# EAGLE schematic linuxstamp122 (EAGLE 5.03)
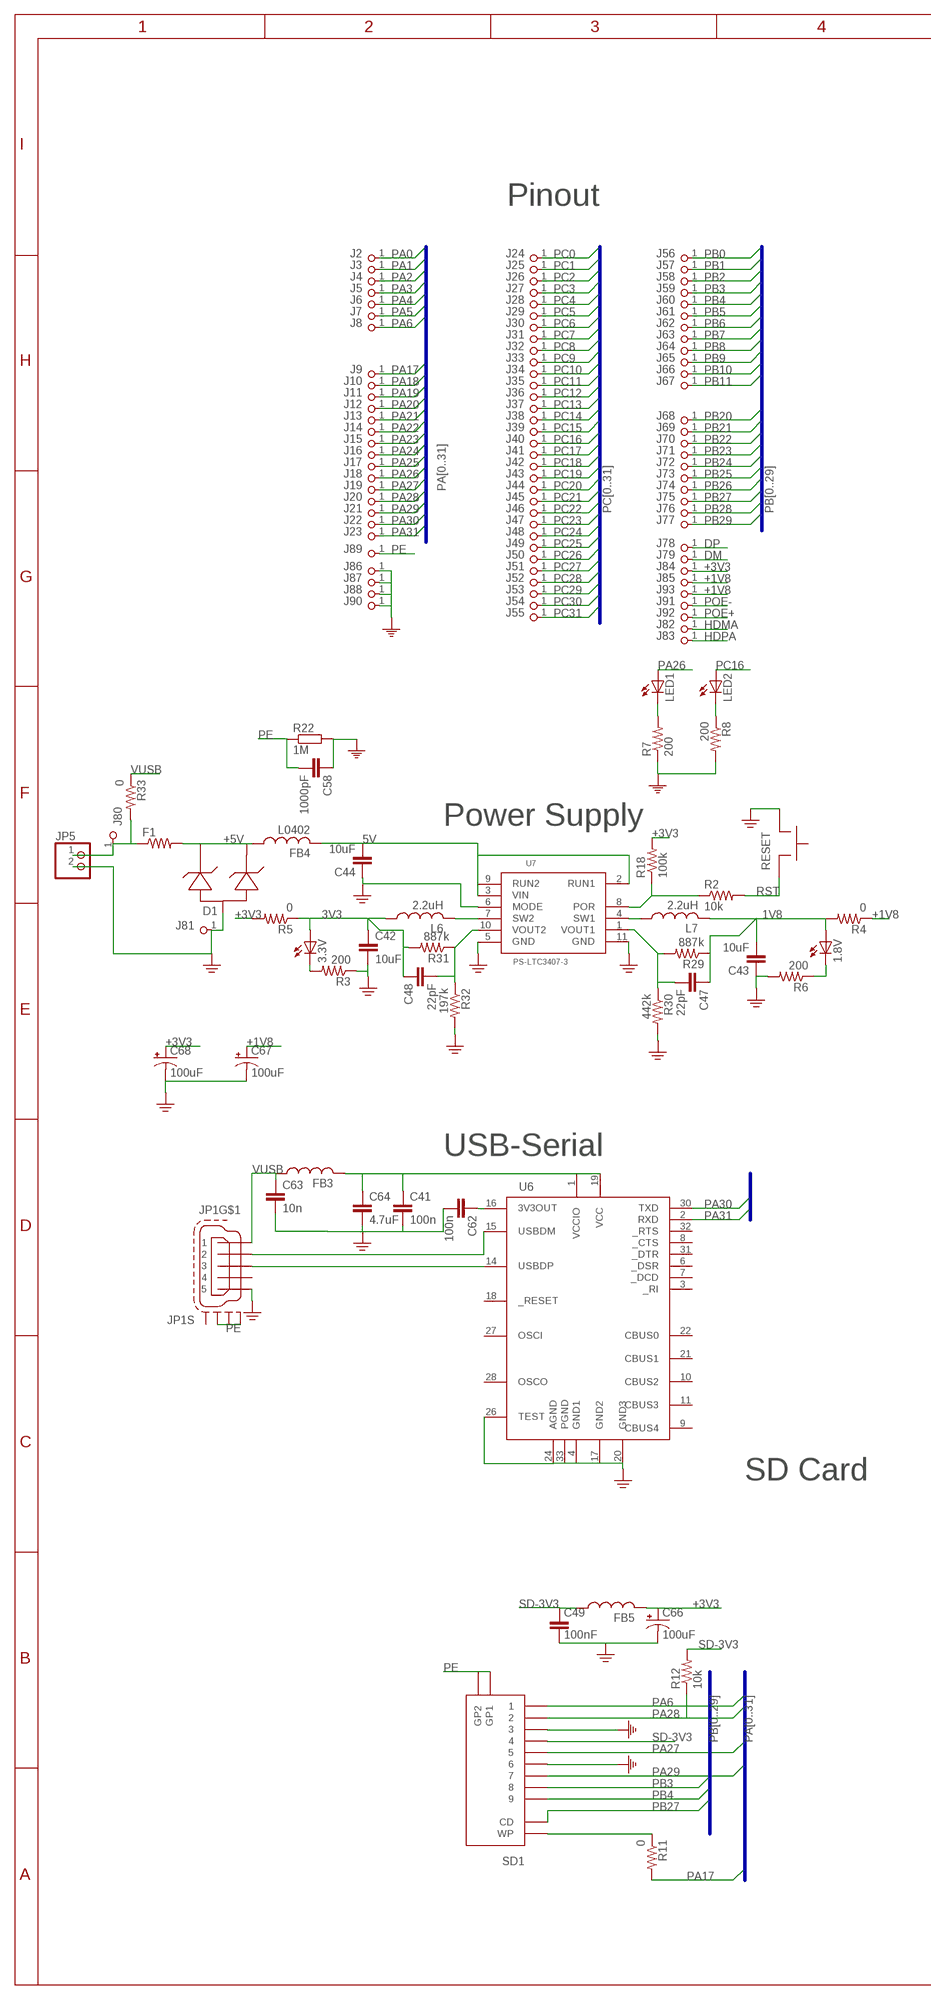
[diagram p0: schematic, sheet 1, part 1 of 2]
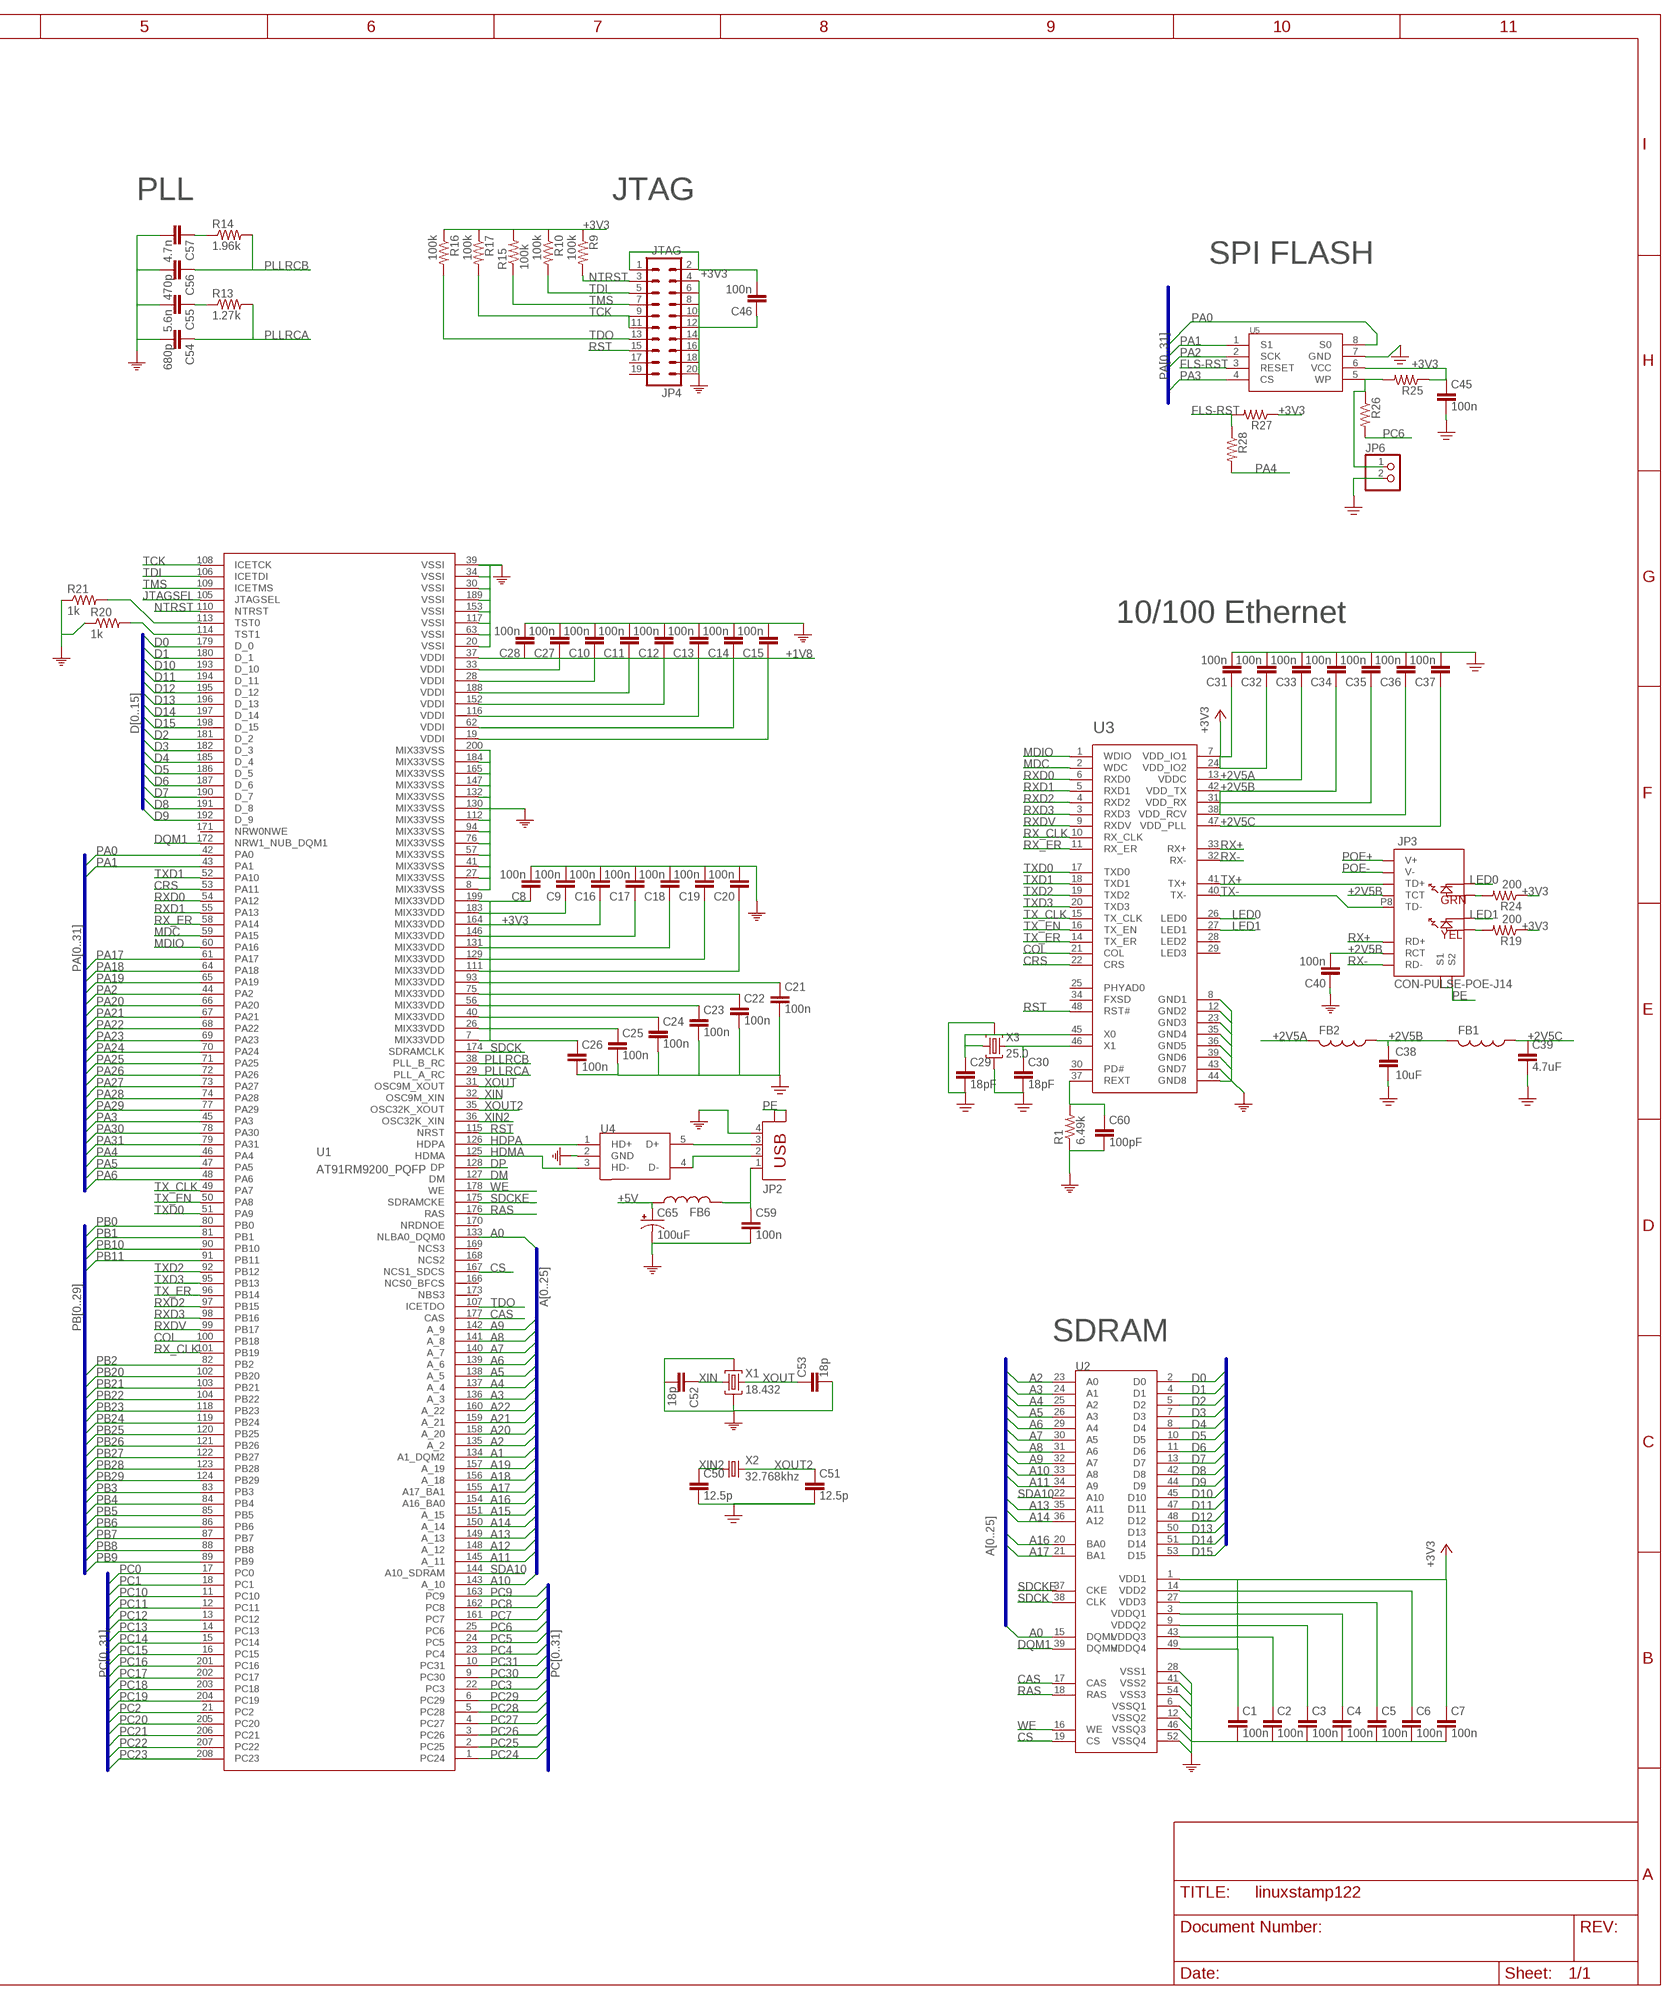
[diagram p1: schematic, sheet 1, part 2 of 2]

## Parts
1.8V  LEDCHIP-LED0603  [CHIP-LED0603]
3.3V  LEDCHIP-LED0603  [CHIP-LED0603]
C1  100n  C-USC0402  [C0402]
C2  100n  C-USC0402  [C0402]
C3  100n  C-USC0402  [C0402]
C4  100n  C-USC0402  [C0402]
C5  100n  C-USC0402  [C0402]
C6  100n  C-USC0402  [C0402]
C7  100n  C-USC0402  [C0402]
C8  100n  C-USC0402  [C0402]
C9  100n  C-USC0402  [C0402]
C10  100n  C-USC0402  [C0402]
C11  100n  C-USC0402  [C0402]
C12  100n  C-USC0402  [C0402]
C13  100n  C-USC0402  [C0402]
C14  100n  C-USC0402  [C0402]
C15  100n  C-USC0402  [C0402]
C16  100n  C-USC0402  [C0402]
C17  100n  C-USC0402  [C0402]
C18  100n  C-USC0402  [C0402]
C19  100n  C-USC0402  [C0402]
C20  100n  C-USC0402  [C0402]
C21  100n  C-USC0402  [C0402]
C22  100n  C-USC0402  [C0402]
C23  100n  C-USC0402  [C0402]
C24  100n  C-USC0402  [C0402]
C25  100n  C-USC0402  [C0402]
C26  100n  C-USC0402  [C0402]
C27  100n  C-USC0402  [C0402]
C28  100n  C-USC0402  [C0402]
C29  18pF  C-USC0402  [C0402]
C30  18pF  C-USC0402  [C0402]
C31  100n  C-USC0402  [C0402]
C32  100n  C-USC0402  [C0402]
C33  100n  C-USC0402  [C0402]
C34  100n  C-USC0402  [C0402]
C35  100n  C-USC0402  [C0402]
C36  100n  C-USC0402  [C0402]
C37  100n  C-USC0402  [C0402]
C38  10uF  C-EUC0805K  [C0805K]
C39  4.7uF  C-USC0603  [C0603]
C40  100n  C-USC0402  [C0402]
C41  100n  C0402  [0402]
C42  10uF  C-EUC0805K  [C0805K]
C43  10uF  C-EUC0805K  [C0805K]
C44  10uF  C-EUC0805K  [C0805K]
C45  100n  C-USC0402  [C0402]
C46  100n  C-USC0402  [C0402]
C47  22pF  C0402  [0402]
C48  22pF  C0402  [0402]
C49  100nF  C-USC0402  [C0402]
C50  12.5p  C-USC0402  [C0402]
C51  12.5p  C-USC0402  [C0402]
C52  18p  C-USC0402  [C0402]
C53  18p  C-USC0402  [C0402]
C54  680p  C-USC0402  [C0402]
C55  5.6n  C-USC0402  [C0402]
C56  470p  C-USC0402  [C0402]
C57  4.7n  C-USC0402  [C0402]
C58  1000pF  C-EUC1206  [C1206]
C59  100n  C-USC0402  [C0402]
C60  100pF  C-USC0402  [C0402]
C62  100n  C0402  [0402]
C63  10n  C0402  [0402]
C64  4.7uF  C-EUC0603  [C0603]
C65  100uF  CPOL-USC/6032-28R  [C/6032-28R]
C66  100uF  CPOL-USC/6032-28R  [C/6032-28R]
C67  100uF  CPOL-USC/6032-28R  [C/6032-28R]
C68  100uF  CPOL-USC/6032-28R  [C/6032-28R]
D1  DIODE-DUAL-ZENER  [SOT23]
F1  R-US_R1206  [R1206]
FB1  L0402  [0402]
FB2  L0402  [0402]
FB3  L0402  [0402]
FB4  L0402  [0402]
FB5  L0402  [0402]
FB6  L0402  [0402]
J2  PINHD-1X1  [1X01]
J3  PINHD-1X1  [1X01]
J4  PINHD-1X1  [1X01]
J5  PINHD-1X1  [1X01]
J6  PINHD-1X1  [1X01]
J7  PINHD-1X1  [1X01]
J8  PINHD-1X1  [1X01]
J9  PINHD-1X1  [1X01]
J10  PINHD-1X1  [1X01]
J11  PINHD-1X1  [1X01]
J12  PINHD-1X1  [1X01]
J13  PINHD-1X1  [1X01]
J14  PINHD-1X1  [1X01]
J15  PINHD-1X1  [1X01]
J16  PINHD-1X1  [1X01]
J17  PINHD-1X1  [1X01]
J18  PINHD-1X1  [1X01]
J19  PINHD-1X1  [1X01]
J20  PINHD-1X1  [1X01]
J21  PINHD-1X1  [1X01]
J22  PINHD-1X1  [1X01]
J23  PINHD-1X1  [1X01]
J24  PINHD-1X1  [1X01]
J25  PINHD-1X1  [1X01]
J26  PINHD-1X1  [1X01]
J27  PINHD-1X1  [1X01]
J28  PINHD-1X1  [1X01]
J29  PINHD-1X1  [1X01]
J30  PINHD-1X1  [1X01]
J31  PINHD-1X1  [1X01]
J32  PINHD-1X1  [1X01]
J33  PINHD-1X1  [1X01]
J34  PINHD-1X1  [1X01]
J35  PINHD-1X1  [1X01]
J36  PINHD-1X1  [1X01]
J37  PINHD-1X1  [1X01]
J38  PINHD-1X1  [1X01]
J39  PINHD-1X1  [1X01]
J40  PINHD-1X1  [1X01]
J41  PINHD-1X1  [1X01]
J42  PINHD-1X1  [1X01]
J43  PINHD-1X1  [1X01]
J44  PINHD-1X1  [1X01]
J45  PINHD-1X1  [1X01]
J46  PINHD-1X1  [1X01]
J47  PINHD-1X1  [1X01]
J48  PINHD-1X1  [1X01]
J49  PINHD-1X1  [1X01]
J50  PINHD-1X1  [1X01]
J51  PINHD-1X1  [1X01]
J52  PINHD-1X1  [1X01]
J53  PINHD-1X1  [1X01]
J54  PINHD-1X1  [1X01]
J55  PINHD-1X1  [1X01]
J56  PINHD-1X1  [1X01]
J57  PINHD-1X1  [1X01]
J58  PINHD-1X1  [1X01]
J59  PINHD-1X1  [1X01]
J60  PINHD-1X1  [1X01]
J61  PINHD-1X1  [1X01]
J62  PINHD-1X1  [1X01]
J63  PINHD-1X1  [1X01]
J64  PINHD-1X1  [1X01]
J65  PINHD-1X1  [1X01]
J66  PINHD-1X1  [1X01]
J67  PINHD-1X1  [1X01]
J68  PINHD-1X1  [1X01]
J69  PINHD-1X1  [1X01]
J70  PINHD-1X1  [1X01]
J71  PINHD-1X1  [1X01]
J72  PINHD-1X1  [1X01]
J73  PINHD-1X1  [1X01]
J74  PINHD-1X1  [1X01]
J75  PINHD-1X1  [1X01]
J76  PINHD-1X1  [1X01]
J77  PINHD-1X1  [1X01]
J78  PINHD-1X1  [1X01]
J79  PINHD-1X1  [1X01]
J80  PINHD-1X1  [1X01]
J81  PINHD-1X1  [1X01]
J82  j85  PINHD-1X1  [1X01]
J83  j85  PINHD-1X1  [1X01]
J84  j85  PINHD-1X1  [1X01]
J85  j85  PINHD-1X1  [1X01]
J86  PINHD-1X1  [1X01]
J87  j85  PINHD-1X1  [1X01]
J88  j85  PINHD-1X1  [1X01]
J89  j85  PINHD-1X1  [1X01]
J90  j85  PINHD-1X1  [1X01]
J91  j85  PINHD-1X1  [1X01]
J92  j85  PINHD-1X1  [1X01]
J93  j85  PINHD-1X1  [1X01]
JP1  MINI-USB-SCHIELD-32005-201  [32005-201]
JP2  PN87520  [PN87520]
JP3  CON-PULSE-POE-J14  [CON-PULSE-POE-J415]
JP4  JTAG  MA10-2  [MA10-2]
JP5  CON-PC-5.0-2  [CON-PC-5.0-2]
JP6  PINHD-1X2  [1X02]
L6  2.2uH  L-USL1812  [L1812]
L7  2.2uH  L-USL1812  [L1812]
LED1  LEDCHIP-LED0603  [CHIP-LED0603]
LED2  LEDCHIP-LED0603  [CHIP-LED0603]
R1  6.49k  R-US_R0402  [R0402]
R2  10k  R0402  [0402]
R3  200  R0402  [0402]
R4  0  R0402  [0402]
R5  0  R0402  [0402]
R6  200  R0402  [0402]
R7  200  R0402  [0402]
R8  200  R0402  [0402]
R9  100k  R-US_R0402  [R0402]
R10  100k  R-US_R0402  [R0402]
R11  0  R-US_R0402  [R0402]
R12  10k  R-US_R0402  [R0402]
R13  1.27k  R-US_R0402  [R0402]
R14  1.96k  R-US_R0402  [R0402]
R15  100k  R-US_R0402  [R0402]
R16  100k  R-US_R0402  [R0402]
R17  100k  R-US_R0402  [R0402]
R18  100k  R0402  [0402]
R19  200  R-US_R0402  [R0402]
R20  1k  R-US_R0402  [R0402]
R21  1k  R-US_R0402  [R0402]
R22  1M  R-EU_R1206  [R1206]
R24  200  R-US_R0402  [R0402]
R25  R-US_R0402  [R0402]
R26  R-US_R0402  [R0402]
R27  R-US_R0402  [R0402]
R28  R-US_R0402  [R0402]
R29  887k  R0402  [0402]
R30  442k  R0402  [0402]
R31  887k  R0402  [0402]
R32  197k  R0402  [0402]
R33  0  R0402  [0402]
RESET  SWITCH-PUSHBUTTON-6X3.5  [SWITCH-6X3.5]
SD1  CON-EM-SD  [CON-3M-SD]
U1  AT91RM9200_PQFP  [LQFP208]
U2  MT48LC8M16A2  [TSOPII-54]
U3  MICREL-KS8721  [TQFP48]
U4  USBDF01W5  [SOT323-5]
U5  DATAFLASH-8  [CASON-8]
U6  FT232RQ2  [MLF32_2]
U7  PS-LTC3407-3  [DFN-10]
X1  18.432  CRYSTAL-3.2-2.5  [CRYSTAL-3.2-2.5]
X2  32.768khz  CRYTALMM20SS  [MM20SS]
X3  25.0  CRYSTAL-3.2-2.5  [CRYSTAL-3.2-2.5]

## Nets
1V8: 1.8V.A C43.2 C47.1 L7.2 R4.2 R29.1
3V3: 3.3V.A C42.1 C48.1 L6.1 R5.1 R31.2
5V: C44.2 FB4.2 U7.2(RUN1) U7.3(VIN) U7.9(RUN2)
+1V8: C10.1 C11.1 C12.1 C13.1 C14.1 C15.1 C27.1 C28.1 C67.+ J85.1 J93.1 R4.1 U1.19(VDDI) U1.28(VDDI) U1.33(VDDI) U1.37(VDDI) U1.62(VDDI) U1.116(VDDI) U1.152(VDDI) U1.188(VDDI)
+2V5A: C33.1 FB2.2 U3.13(VDDC)
+2V5B: C34.1 C35.1 C36.1 C38.1 C40.2 FB1.2 FB2.1 JP3.P1(TCT) JP3.P9(RCT) U3.31(VDD_RX) U3.38(VDD_RCV) U3.42(VDD_TX)
+2V5C: C37.1 C39.1 FB1.1 U3.47(VDD_PLL)
+3V3: C1.1 C2.1 C3.1 C4.1 C5.1 C6.1 C7.1 C8.1 C9.1 C16.1 C17.1 C18.1 C19.1 C20.1 C21.1 C22.1 C23.1 C24.1 C25.1 C26.1 C31.1 C32.1 C45.1 C46.2 C66.+ C68.+ FB5.2 J84.1 JP4.1 JP4.2 R5.2 R9.1 R10.1 R15.2 R16.1 R17.1 R18.2 R19.1 R24.1 R25.1 R27.1 U1.7(MIX33VDD) U1.26(MIX33VDD) U1.40(MIX33VDD) U1.56(MIX33VDD) U1.75(MIX33VDD) U1.93(MIX33VDD) U1.111(MIX33VDD) U1.129(MIX33VDD) U1.131(MIX33VDD) U1.146(MIX33VDD) U1.164(MIX33VDD) U1.183(MIX33VDD) U1.199(MIX33VDD) U2.1(VDD1) U2.3(VDDQ1) U2.9(VDDQ2) U2.14(VDD2) U2.27(VDD3) U2.43(VDDQ3) U2.49(VDDQ4) U3.7(VDD_IO1) U3.24(VDD_IO2) U5.6(VCC)
+5V: C65.+ D1.1 D1.2 F1.2 FB4.1 FB6.1
A0: U1.133(NLBA0_DQM0) U2.15(DQML)
A1: U1.134(A1_DQM2)
A2: U1.135(A_2) U2.23(A0)
A3: U1.136(A_3) U2.24(A1)
A4: U1.137(A_4) U2.25(A2)
A5: U1.138(A_5) U2.26(A3)
A6: U1.139(A_6) U2.29(A4)
A7: U1.140(A_7) U2.30(A5)
A8: U1.141(A_8) U2.31(A6)
A9: U1.142(A_9) U2.32(A7)
A10: U1.143(A_10) U2.33(A8)
A11: U1.145(A_11) U2.34(A9)
A12: U1.148(A_12)
A13: U1.149(A_13) U2.35(A11)
A14: U1.150(A_14) U2.36(A12)
A15: U1.151(A_15)
A16: U1.154(A16_BA0) U2.20(BA0)
A17: U1.155(A17_BA1) U2.21(BA1)
A18: U1.156(A_18)
A19: U1.157(A_19)
A20: U1.158(A_20)
A21: U1.159(A_21)
A22: U1.160(A_22)
CAS: U1.177(CAS) U2.17(CAS)
COL: U1.100(PB18) U3.21(COL)
CRS: U1.53(PA11) U3.22(CRS)
CS: U1.167(NCS1_SDCS) U2.19(CS)
D0: U1.179(D_0) U2.2(D0)
D1: U1.180(D_1) U2.4(D1)
D2: U1.181(D_2) U2.5(D2)
D3: U1.182(D_3) U2.7(D3)
D4: U1.185(D_4) U2.8(D4)
D5: U1.186(D_5) U2.10(D5)
D6: U1.187(D_6) U2.11(D6)
D7: U1.190(D_7) U2.13(D7)
D8: U1.191(D_8) U2.42(D8)
D9: U1.192(D_9) U2.44(D9)
D10: U1.193(D_10) U2.45(D10)
D11: U1.194(D_11) U2.47(D11)
D12: U1.195(D_12) U2.48(D12)
D13: U1.196(D_13) U2.50(D13)
D14: U1.197(D_14) U2.51(D14)
D15: U1.198(D_15) U2.53(D15)
DM: J79.1 U1.127(DM)
DP: J78.1 U1.128(DP)
DQM1: U1.172(NRW1_NUB_DQM1) U2.39(DQMH)
FLS-RST: R27.2 R28.1 U5.3(RESET)
GND: C1.2 C2.2 C3.2 C4.2 C5.2 C6.2 C7.2 C8.2 C9.2 C10.2 C11.2 C12.2 C13.2 C14.2 C15.2 C16.2 C17.2 C18.2 C19.2 C20.2 C21.2 C22.2 C23.2 C24.2 C25.2 C26.2 C27.2 C28.2 C29.2 C30.2 C31.2 C32.2 C33.2 C34.2 C35.2 C36.2 C37.2 C38.2 C39.2 C40.1 C41.2 C42.2 C43.1 C44.1 C45.2 C46.1 C49.2 C50.2 C51.2 C52.2 C53.2 C54.2 C55.2 C56.2 C57.2 C58.1 C59.2 C60.2 C62.2 C63.2 C64.2 C65.- C66.- C67.- C68.- D1.3 J81.1 J86.1 J87.1 J88.1 J90.1 JP1.5 JP2.4 JP4.4 JP4.6 JP4.8 JP4.10 JP4.12 JP4.14 JP4.16 JP4.18 JP4.20 JP5.2 JP6.2 R1.1 R3.1 R6.2 R7.1 R8.2 R20.1 R21.1 R22.2 R30.2 R32.2 RESET.1 SD1.3 SD1.6 U1.8(MIX33VSS) U1.20(VSSI) U1.27(MIX33VSS) U1.30(VSSI) U1.34(VSSI) U1.39(VSSI) U1.41(MIX33VSS) U1.57(MIX33VSS) U1.63(VSSI) U1.76(MIX33VSS) U1.94(MIX33VSS) U1.112(MIX33VSS) U1.117(VSSI) U1.130(MIX33VSS) U1.132(MIX33VSS) U1.147(MIX33VSS) U1.153(VSSI) U1.165(MIX33VSS) U1.184(MIX33VSS) U1.189(VSSI) U1.200(MIX33VSS) U2.6(VSSQ1) U2.12(VSSQ2) U2.28(VSS1) U2.41(VSS2) U2.46(VSSQ3) U2.52(VSSQ4) U2.54(VSS3) U3.8(GND1) U3.12(GND2) U3.23(GND3) U3.35(GND4) U3.36(GND5) U3.39(GND6) U3.43(GND7) U3.44(GND8) U4.2(GND) U5.7(GND) U6.4(GND1) U6.17(GND2) U6.20(GND3) U6.24(AGND) U6.26(TEST) U6.33(PGND) U7.5(GND) U7.6(MODE) U7.11(GND) X1.2(GND) X1.4(GND) X3.2(GND) X3.4(GND)
HDMA: J82.1 U1.125(HDMA) U4.3(HD-)
HDPA: J83.1 U1.126(HDPA) U4.1(HD+)
J1: JP2.2 U4.4(D-)
JTAGSEL: U1.105(JTAGSEL)
LED0: JP3.P13(GC) U3.26(LED0)
LED1: JP3.P16(YC) U3.27(LED1)
MDC: U1.59(PA15) U3.2(WDC)
MDIO: U1.60(PA16) U3.1(WDIO)
N$1: JP3.P14(GA) R24.2
N$2: JP3.P15(YA) R19.2
N$3: 3.3V.C R3.2
N$5: C30.1 U3.46(X1) X3.3(C2)
N$6: C29.1 U3.45(X0) X3.1(C1)
N$7: C60.1 R1.2 U3.37(REXT)
N$8: C59.1 FB6.2 JP2.1
N$10: JP2.3 U4.5(D+)
N$11: L6.2 U7.7(SW2)
N$12: JP1.3 U6.14(USBDP)
N$13: C47.2 R29.2 R30.1 U7.1(VOUT1)
N$14: JP1.2 U6.15(USBDM)
N$15: C41.1 C64.1 FB3.2 U6.1(VCCIO) U6.19(VCC)
N$16: C62.1 U6.16(3V3OUT)
N$17: L7.1 U7.4(SW1)
N$18: R2.1 R18.1 U7.8(POR)
N$19: C48.2 R31.1 R32.1 U7.10(VOUT2)
N$20: 1.8V.C R6.1
N$21: LED1.C R7.2
N$22: LED2.C R8.1
N$23: JP6.1 R25.2 R26.1 U5.5(WP)
N$24: F1.1 J80.1 JP5.1 R33.2
N$35: R11.1 SD1.WP
N$37: C55.1 R13.1
N$39: C57.1 R14.1
N$41: R20.2 U1.114(TST1)
N$42: R21.2 U1.113(TST0)
NTRST: JP4.3 R9.2 U1.110(NTRST)
PA0: J2.1 U1.42(PA0) U5.8(S0)
PA1: J3.1 U1.43(PA1) U5.1(S1)
PA2: J4.1 U1.44(PA2) U5.2(SCK)
PA3: J5.1 U1.45(PA3) U5.4(CS)
PA4: J6.1 R28.2 U1.46(PA4)
PA5: J7.1 U1.47(PA5)
PA6: J8.1 SD1.1 U1.48(PA6)
PA17: J9.1 R11.2 U1.61(PA17)
PA18: J10.1 U1.64(PA18)
PA19: J11.1 U1.65(PA19)
PA20: J12.1 U1.66(PA20)
PA21: J13.1 U1.67(PA21)
PA22: J14.1 U1.68(PA22)
PA23: J15.1 U1.69(PA23)
PA24: J16.1 U1.70(PA24)
PA25: J17.1 U1.71(PA25)
PA26: J18.1 LED1.A U1.72(PA26)
PA27: J19.1 SD1.5 U1.73(PA27)
PA28: J20.1 R12.1 SD1.2 U1.74(PA28)
PA29: J21.1 SD1.7 U1.77(PA29)
PA30: J22.1 U1.78(PA30) U6.30(TXD)
PA31: J23.1 U1.79(PA31) U6.2(RXD)
PB0: J56.1 U1.80(PB0)
PB1: J57.1 U1.81(PB1)
PB2: J58.1 U1.82(PB2)
PB3: J59.1 SD1.8 U1.83(PB3)
PB4: J60.1 SD1.9 U1.84(PB4)
PB5: J61.1 U1.85(PB5)
PB6: J62.1 U1.86(PB6)
PB7: J63.1 U1.87(PB7)
PB8: J64.1 U1.88(PB8)
PB9: J65.1 U1.89(PB9)
PB10: J66.1 U1.90(PB10)
PB11: J67.1 U1.91(PB11)
PB20: J68.1 U1.102(PB20)
PB21: J69.1 U1.103(PB21)
PB22: J70.1 U1.104(PB22)
PB23: J71.1 U1.118(PB23)
PB24: J72.1 U1.119(PB24)
PB25: J73.1 U1.120(PB25)
PB26: J74.1 U1.121(PB26)
PB27: J75.1 SD1.CD U1.122(PB27)
PB28: J76.1 U1.123(PB28)
PB29: J77.1 U1.124(PB29)
PC0: J24.1 U1.17(PC0)
PC1: J25.1 U1.18(PC1)
PC2: J26.1 U1.21(PC2)
PC3: J27.1 U1.22(PC3)
PC4: J28.1 U1.23(PC4)
PC5: J29.1 U1.24(PC5)
PC6: J30.1 R26.2 U1.25(PC6)
PC7: J31.1 U1.161(PC7)
PC8: J32.1 U1.162(PC8)
PC9: J33.1 U1.163(PC9)
PC10: J34.1 U1.11(PC10)
PC11: J35.1 U1.12(PC11)
PC12: J36.1 U1.13(PC12)
PC13: J37.1 U1.14(PC13)
PC14: J38.1 U1.15(PC14)
PC15: J39.1 U1.16(PC15)
PC16: J40.1 LED2.A U1.201(PC16)
PC17: J41.1 U1.202(PC17)
PC18: J42.1 U1.203(PC18)
PC19: J43.1 U1.204(PC19)
PC20: J44.1 U1.205(PC20)
PC21: J45.1 U1.206(PC21)
PC22: J46.1 U1.207(PC22)
PC23: J47.1 U1.208(PC23)
PC24: J48.1 U1.1(PC24)
PC25: J49.1 U1.2(PC25)
PC26: J50.1 U1.3(PC26)
PC27: J51.1 U1.4(PC27)
PC28: J52.1 U1.5(PC28)
PC29: J53.1 U1.6(PC29)
PC30: J54.1 U1.9(PC30)
PC31: J55.1 U1.10(PC31)
PE: C58.2 J89.1 JP1.M1(S:S1) JP1.M2(S:S2) JP1.M3(S:S3) JP2.G1 JP2.G2 JP3.S1 JP3.S2 R22.1 SD1.GP1 SD1.GP2
PLLRCA: C54.1 R13.2 U1.29(PLL_A_RC)
PLLRCB: C56.1 R14.2 U1.38(PLL_B_RC)
POE+: J92.1 JP3.P5(V+)
POE-: J91.1 JP3.P6(V-)
RAS: U1.176(RAS) U2.18(RAS)
RST: JP4.15 R2.2 RESET.2 U1.115(NRST) U3.48(RST#)
RX+: JP3.P2(RD+) U3.33(RX+)
RX-: JP3.P3(RD-) U3.32(RX-)
RX_CLK: U1.101(PB19) U3.10(RX_CLK)
RX_ER: U1.58(PA14) U3.11(RX_ER)
RXD0: U1.54(PA12) U3.6(RXD0)
RXD1: U1.55(PA13) U3.5(RXD1)
RXD2: U1.97(PB15) U3.4(RXD2)
RXD3: U1.98(PB16) U3.3(RXD3)
RXDV: U1.99(PB17) U3.9(RXDV)
SD-3V3: C49.1 FB5.1 R12.2 SD1.4
SDA10: U1.144(A10_SDRAM) U2.22(A10)
SDCK: U1.174(SDRAMCLK) U2.38(CLK)
SDCKE: U1.175(SDRAMCKE) U2.37(CKE)
TCK: JP4.9 JP4.11 R17.2 U1.108(ICETCK)
TDI: JP4.5 R10.2 U1.106(ICETDI)
TDO: JP4.13 R16.2 U1.107(ICETDO)
TMS: JP4.7 R15.1 U1.109(ICETMS)
TX+: JP3.P7(TD+) U3.41(TX+)
TX-: JP3.P8(TD-) U3.40(TX-)
TX_CLK: U1.49(PA7) U3.15(TX_CLK)
TX_EN: U1.50(PA8) U3.16(TX_EN)
TX_ER: U1.96(PB14) U3.14(TX_ER)
TXD0: U1.51(PA9) U3.17(TXD0)
TXD1: U1.52(PA10) U3.18(TXD1)
TXD2: U1.92(PB12) U3.19(TXD2)
TXD3: U1.95(PB13) U3.20(TXD3)
VUSB: C63.1 FB3.1 JP1.1 R33.1
WE: U1.178(WE) U2.16(WE)
XIN: C52.1 U1.32(OSC9M_XIN) X1.1(C1)
XIN2: C50.1 U1.36(OSC32K_XIN) X2.1
XOUT: C53.1 U1.31(OSC9M_XOUT) X1.3(C2)
XOUT2: C51.1 U1.35(OSC32K_XOUT) X2.4
Unconnected: JP1.4 JP1.M4(S:S4) JP4.17 JP4.19 U1.166(NCS0_BFCS) U1.168(NCS2) U1.169(NCS3) U1.170(NRDNOE) U1.171(NRW0NWE) U1.173(NBS3) U3.25(PHYAD0) U3.28(LED2) U3.29(LED3) U3.30(PD#) U3.34(FXSD) U6.3(_RI) U6.6(_DSR) U6.7(_DCD) U6.8(_CTS) U6.9(CBUS4) U6.10(CBUS2) U6.11(CBUS3) U6.18(_RESET) U6.21(CBUS1) U6.22(CBUS0) U6.27(OSCI) U6.28(OSCO) U6.31(_DTR) U6.32(_RTS)

## Buses
D[0..15]
A[0..25]
PA[0..31]
PB[0..29]
PC[0..31]

## Notes on the sheet
- Pinout | PLL | JTAG
- SPI FLASH
- 10/100 Ethernet
- Power Supply
- U4
- USB-Serial
- SDRAM
- SD Card

## Library data of the parts
1.8V 3.3V LED1 LED2 = led:LED: LED OSRAM: - CHIPLED LG R971, LG N971, LY N971, LG Q971, LY Q971, LO R971, LY R971 LH N974, LH R974 LS Q976, LO Q976, LY Q976 LO Q996 - Hyper CHIPLED LW Q18S LB Q993, LB Q99A, LB R99A - SideLED LS A670, LO A670, LY A670, LG A670, LP A670 LB A673, LV A673, LT A673, LW A673 LH A674 LY A675 LS A676, LA A676, LO A676, LY A676, LW A676 LS A679, LY A679, LG A679 - Hyper Micro SIDELED® LS Y876, LA Y876, LO Y876, LY Y876 LT Y87S - SmartLED LW L88C, LW L88S LB L89C, LB L89S, LG L890 LS L89K, LO L89K, LY L89K LS L896, LA L896, LO L896, LY L896 - TOPLED LS T670, LO T670, LY T670, LG T670, LP T670 LSG T670, LSP T670, LSY T670, LOP T670, LYG T670 LG T671, LOG T671, LSG T671 LB T673, LV T673, LT T673, LW T673 LH T674 LS T676, LA T676, LO T676, LY T676, LB T676, LH T676, LSB T676, LW T676 LB T67C, LV T67C, LT T67C, LS T67K, LO T67K, LY T67K, LW E67C LS E67B, LA E67B, LO E67B, LY E67B, LB E67C, LV E67C, LT E67C LW T67C LS T679, LY T679, LG T679 LS T770, LO T770, LY T770, LG T770, LP T770 LB T773, LV T773, LT T773, LW T773 LH T774 LS E675, LA E675, LY E675, LS T675 LS T776, LA T776, LO T776, LY T776, LB T776 LHGB T686 LT T68C, LB T68C - Hyper Mini TOPLED® LB M676 - Mini TOPLED Santana® LG M470 LS M47K, LO M47K, LY M47K Source: http://www.osram.convergy.de - LUMILED® LXK2-PW12-R00, LXK2-PW12-S00, LXK2-PW14-U00, LXK2-PW14-V00 LXK2-PM12-R00, LXK2-PM12-S00, LXK2-PM14-U00 LXK2-PE12-Q00, LXK2-PE12-R00, LXK2-PE12-S00, LXK2-PE14-T00, LXK2-PE14-U00 LXK2-PB12-K00, LXK2-PB12-L00, LXK2-PB12-M00, LXK2-PB14-N00, LXK2-PB14-P00, LXK2-PB14-Q00 LXK2-PR12-L00, LXK2-PR12-M00, LXK2-PR14-Q00, LXK2-PR14-R00 LXK2-PD12-Q00, LXK2-PD12-R00, LXK2-PD12-S00 LXK2-PH12-R00, LXK2-PH12-S00 LXK2-PL12-P00, LXK2-PL12-Q00, LXK2-PL12-R00 Source: www.luxeon.com
C1-C37 C39 C40 C45 C46 C49-C57 C59 C60 = rcl:C-US: CAPACITOR, American symbol
C38 C42-C44 C58 C64 = rcl:C-EU: CAPACITOR, European symbol
C41 C47 C48 C62 C63 = cc2430:C0402
C65-C68 = rcl:CPOL-US: POLARIZED CAPACITOR, American symbol
D1 = mylib:DIODE-DUAL-ZENER
F1 = rcl2:R-US_: RESISTOR, American symbol
FB1-FB6 = cc2430:L0402
J2-J93 = pinhead:PINHD-1X1: PIN HEADER
JP1 = con-cypressindustries:MINI-USB-SCHIELD-: MINI USB-B Conector Source: www.cypressindustries.com
JP2 = con-berg:PN87520: BERG USB connector
JP3 = mylib:CON-PULSE-POE-J14
JP4 = con-lstb:MA10-2: PIN HEADER
JP5 = mylib:CON-PC-5.0-2
JP6 = pinhead:PINHD-1X2: PIN HEADER
L6 L7 = rcl:L-US: INDUCTOR, American symbol
R1 R9-R17 R19-R21 R24-R28 = rcl:R-US_: RESISTOR, American symbol
R2-R8 R18 R29-R33 = cc2430:R0402
R22 = rcl:R-EU_: RESISTOR, European symbol
RESET = mylib:SWITCH-PUSHBUTTON-6X3.5
SD1 = mylib:CON-EM-SD
U1 = atmel:AT91RM9200_PQFP: at91rm9200_pqfp.bsd Auto generated by make-symbol-device-package-bsdl.ulp Rev. 7 Source: at91rm9200_pqfp.bsd
U2 = atmel:MT48LC8M16A2
U3 = atmel:MICREL-KS8721
U4 = atmel:USBDF01W5
U5 = atmel:DATAFLASH-8
U6 = ftdichip:FT232RQ2
U7 = mylib:PS-LTC3407-3
X1 X3 = mylib:CRYSTAL-3.2-2.5
X2 = crystal:CRYTAL: CRYSTAL